# EAGLE design 5v-3.3v Stepdown Breakout (EAGLE 9.5.2)
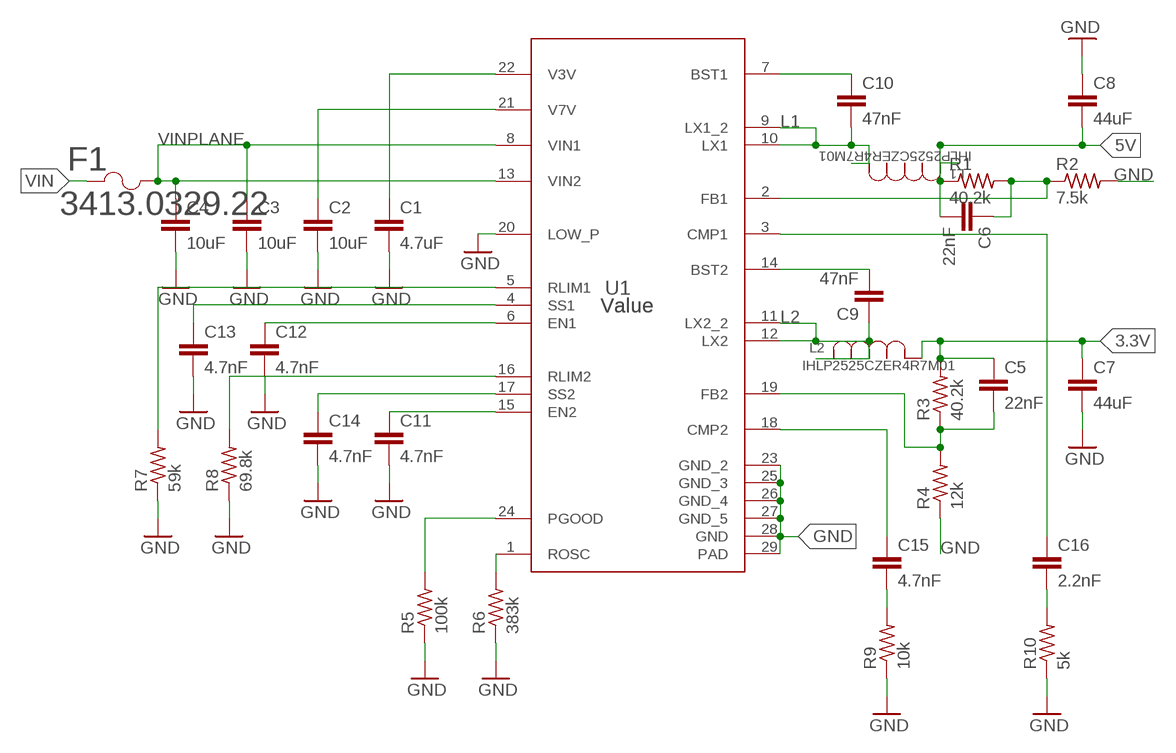
[diagram p0: schematic, sheet 1]

## Parts
C1  4.7uF  4.7UF-0402_TIGHT-6.3V-20%-X5R  [0402-TIGHT]
C2  10uF  10UF-0603-6.3V-20%  [0603]
C3  10uF  10UF-0603-6.3V-20%  [0603]
C4  10uF  10UF-0603-6.3V-20%  [0603]
C5  22nF  22NF/22,000PF-0603-25V-10%-X7R  [0402]
C6  22nF  22NF/22,000PF-0603-25V-10%-X7R  [0402]
C7  44uF  6PF-0402-50V-0.5%  [0402]
C8  44uF  6PF-0402-50V-0.5%  [0402]
C9  47nF  47NF-0402_TIGHT-25V-10%-X7R  [0402-TIGHT]
C10  47nF  47NF-0402_TIGHT-25V-10%-X7R  [0402-TIGHT]
C11  4.7nF  47NF-0402_TIGHT-25V-10%-X7R  [0402-TIGHT]
C12  4.7nF  47NF-0402_TIGHT-25V-10%-X7R  [0402-TIGHT]
C13  4.7nF  47NF-0402_TIGHT-25V-10%-X7R  [0402-TIGHT]
C14  4.7nF  47NF-0402_TIGHT-25V-10%-X7R  [0402-TIGHT]
C15  4.7nF  47NF-0402_TIGHT-25V-10%-X7R  [0402-TIGHT]
C16  2.2nF  47NF-0402_TIGHT-25V-10%-X7R  [0402-TIGHT]
F1  3413.0329.22  [FUS_SCHURTER_3413_SCH]
L1  IHLP2525CZER4R7M01  [IND25X25CZ]
L2  IHLP2525CZER4R7M01  [IND25X25CZ]
R1  40.2k  R-US_R0402  [R0402]
R2  7.5k  R-US_R0402  [R0402]
R3  40.2k  R-US_R0402  [R0402]
R4  12k  R-US_R0402  [R0402]
R5  100k  R-US_R0402  [R0402]
R6  383k  R-US_R0402  [R0402]
R7  59k  R-US_R0402  [R0402]
R8  69.8k  R-US_R0402  [R0402]
R9  10k  R-US_R0402  [R0402]
R10  5k  R-US_R0402  [R0402]
U1  Value  TPS65253RHDR  [RHD0028A]

## Nets
3.3V: C5.1 C7.1 L2.1 R3.2
5V: C6.2 C8.2 L1.2 R1.1
GND: C1.2 C2.2 C3.2 C4.2 C7.2 C8.1 C11.2 C12.2 C13.2 C14.2 R2.2 R4.1 R5.1 R6.1 R7.1 R8.1 R9.1 R10.1 U1.20(LOW_P) U1.23(GND_2) U1.25(GND_3) U1.26(GND_4) U1.27(GND_5) U1.28(GND) U1.29(PAD)
L1: C10.2 L1.1 U1.9(LX1_2) U1.10(LX1)
L2: C9.1 L2.2 U1.11(LX2_2) U1.12(LX2)
N$1: C2.1 U1.21(V7V)
N$2: C1.1 U1.22(V3V)
N$5: C5.2 R3.1 R4.2 U1.19(FB2)
N$6: C6.1 R1.2 R2.1 U1.2(FB1)
N$9: C9.2 U1.14(BST2)
N$10: C10.1 U1.7(BST1)
N$11: C12.1 U1.6(EN1)
N$12: C11.1 U1.15(EN2)
N$13: R5.2 U1.24(PGOOD)
N$14: C14.1 U1.17(SS2)
N$15: R6.2 U1.1(ROSC)
N$16: C13.1 U1.4(SS1)
N$17: R8.2 U1.16(RLIM2)
N$18: R7.2 U1.5(RLIM1)
N$19: C15.2 R9.2
N$20: C15.1 U1.18(CMP2)
N$21: C16.1 U1.3(CMP1)
N$22: C16.2 R10.2
VIN: F1.1
VINPLANE: C3.1 C4.1 F1.2 U1.8(VIN1) U1.13(VIN2)

## Library data of the parts
C1 = SparkFun-Capacitors:4.7UF: 4.7µF ceramic capacitors A capacitor is a passive two-terminal electrical component used to store electrical energy temporarily in an electric field.; PROD_ID: CAP-14240
C2-C4 = SparkFun-Capacitors:10UF: 10.0µF ceramic capacitors A capacitor is a passive two-terminal electrical component used to store electrical energy temporarily in an electric field.; PROD_ID: CAP-11015
C5 C6 = SparkFun-Capacitors:22NF/22,000PF: 0.022uF/22nF/22,000pF ceramic capacitors A capacitor is a passive two-terminal electrical component used to store electrical energy temporarily in an electric field.; PROD_ID: CAP-15062
C7 C8 = SparkFun-Capacitors:6PF: 6pF ceramic capacitors A capacitor is a passive two-terminal electrical component used to store electrical energy temporarily in an electric field.; PROD_ID: CAP-13455; VALUE: 6pF
C9 C10 = SparkFun-Capacitors:47NF: 47nF ceramic capacitors A capacitor is a passive two-terminal electrical component used to store electrical energy temporarily in an electric field.; PROD_ID: CAP-14243
C11-C16 = SparkFun-Capacitors:47NF: 47nF ceramic capacitors A capacitor is a passive two-terminal electrical component used to store electrical energy temporarily in an electric field.; PROD_ID: CAP-14243; VALUE: 47nF
F1 = 3413.0329.22 fuse:3413.0329.22; BUILT_BY: EMA_UL_Team; MANUFACTURER_PART_NUMBER: 3413.0329.22; SOURCELIBRARY: Schurter_2010-01-01_FUSE_3413; VENDOR: Schurter Inc
L1 L2 = IHLP2525CZER4R7M01:IHLP2525CZER4R7M01; BUILT_BY: EMA_UL_Team; MANUFACTURER_PART_NUMBER: IHLP2525CZER4R7M01; VENDOR: Vishay
R1-R10 = resistor:R-US_: RESISTOR, American symbol
U1 = TPS65253:TPS65253RHDR; MANUFACTURER: Texas Instruments; PARTNUMBER: TPS65253RHDR; REFDES: RefDes; TYPE: TYPE

## Board
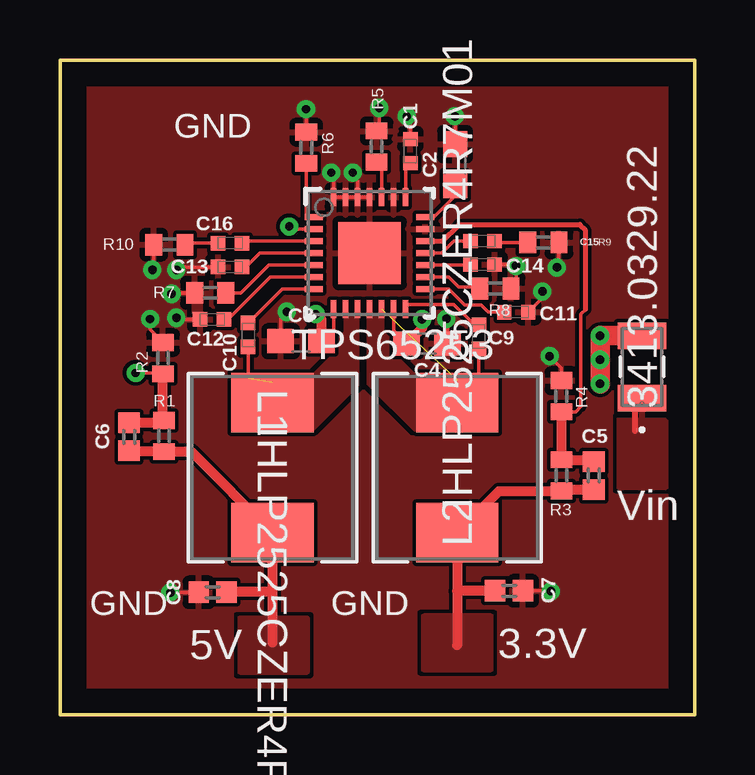
[diagram p1: board, top side]
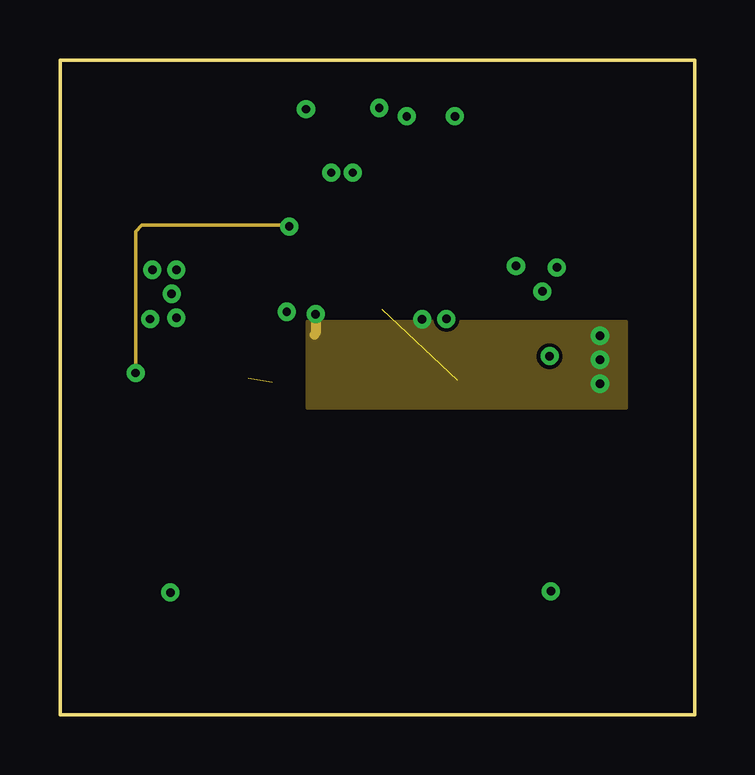
[diagram p2: board, inner layer Route15]
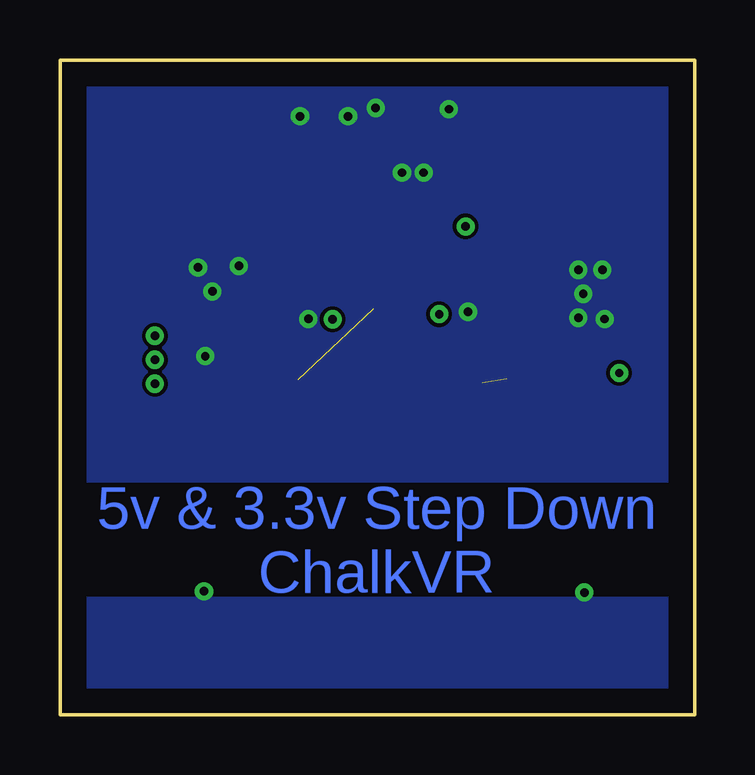
[diagram p3: board, bottom side, seen from below]

Size 26.45 x 27.3 mm. Coordinates in mm from the lower left corner, seen from the top.
Outline: 0,27.3 0,0 26.45,0 26.45,27.3 0,27.3
Copper layers (1+2*15+16): Top 0.035mm / dielectric 1.5mm / Route2 0.035mm / dielectric 0.15mm / Route15 0.035mm / dielectric 0.2mm / Bottom 0.035mm
Design rules "default *": minimum track width 6mil, minimum drill 0.35mm, track to track 6mil, track to pad 6mil, pad to pad 6mil, via to via 6mil, smd to smd 6mil, copper to edge 40mil, drill to drill 6mil, minimum pad ring 10mil, minimum via ring 8mil, stop-mask expansion 4mil, vias tented up to drill 0mil, thermal gap 10mil

### Footprints (pad centres in the part's own frame; a part is rotated, then mirrored left to right if it is on the bottom)
0402-TIGHT = smd 0.6 x 0.6: 1 -0.5,0; 2 0.5,0
0603 = smd 1.1 x 1: 1 -0.85,0; 2 0.85,0
0402 = smd 0.85 x 0.9: 1 -0.58,0; 2 0.58,0
FUS_SCHURTER_3413_SCH = smd 1.105 x 2.007: 1 -1.302,0; 2 1.302,0
IND25X25CZ = smd 2.479 x 3.429: 1 -2.713,0; 2 2.713,0
R0402 = smd 0.7 x 0.9: 1 -0.65,0; 2 0.65,0
RHD0028A = smd 0.75 x 0.24: 1 -2.325,1.5; 2 -2.325,1; 3 -2.325,0.5; 4 -2.325,0; 5 -2.325,-0.5; 6 -2.325,-1; 7 -2.325,-1.5; 15 2.325,-1.5; 16 2.325,-1; 17 2.325,-0.5; 18 2.325,0; 19 2.325,0.5; 20 2.325,1; 21 2.325,1.5 | smd 0.24 x 0.75: 8 -1.5,-2.325; 9 -1,-2.325; 10 -0.5,-2.325; 11 0,-2.325; 12 0.5,-2.325; 13 1,-2.325; 14 1.5,-2.325; 22 1.5,2.325; 23 1,2.325; 24 0.5,2.325; 25 0,2.325; 26 -0.5,2.325; 27 -1,2.325; 28 -1.5,2.325 | smd 2.6 x 2.6: 29 0,0

### Placement (x,y rotation side)
C1  14.6,23.5 90 top
C2  16.46,22.94 90 top
C3  10.04,15.58 180 top
C4  15.29,15.47 0 top
C5  22.24,9.97 90 top
C6  2.88,11.59 270 top
C7  18.71,5.17 0 top
C8  6.36,5.11 0 top
C9  17.45,15.76 90 top
C10  7.84,15.84 270 top
C11  19.01,16.78 0 top
C12  6.34,16.48 180 top
C13  7.09,18.67 180 top
C14  17.61,18.77 0 top
C15  17.61,19.75 0 top
C16  7.09,19.66 180 top
F1  24.25,14.5 90 top
L1  8.85,10.3 270 top
L2  16.55,10.3 90 top
R1  4.33,11.62 90 top
R2  4.29,14.87 90 top
R3  20.9,9.98 270 top
R4  20.89,13.28 270 top
R5  13.19,23.69 270 top
R6  10.26,23.64 270 top
R7  6.26,17.59 0 top
R8  18.14,17.77 180 top
R9  20.14,19.69 180 top
R10  4.56,19.6 0 top
U1  12.9,19.25 0 top

### Tracks (layer width: path | path; a pad name or v marks a point on that pad's centre or on a via)
3.3V
  Top 0.152: 22.15,9.39 C5.1
  Top 0.406: 16.55,5.15 L2.1 18.29,9.33 R3.2 20.96,9.39 22.15,9.39 | 16.55,5.15 16.55,2.9 | C7.1 16.57,5.17 16.55,5.15
  pour Top: 15.15,4.1 15.15,1.9 17.95,1.9 17.95,4.1
5V
  Top 0.406: 8.85,5.15 L1.2 5.47,10.97 R1.1 2.92,10.97 C6.2 | 8.85,5.15 8.85,3 | C8.2 6.98,5.15 8.85,5.15
  pour Top: 10.3,4 7.5,4 7.5,1.8 10.3,1.8
GND  (via drill 0.35)
  Top 0.152: C3.2 9.19,16.54 v9.45,16.8 | C4.2 16.14,16.46 v16.1,16.5 | C7.2 20.43,5.17 v20.45,5.15 | C8.1 v4.6,5.1 | R5.1 13.3,24.45 v13.3,25.3 | C1.2 14.6,24.8 v14.45,24.95 | v10.25,25.25 R6.1 | C13.2 4.97,18.67 v4.85,18.55 | R7.1 4.69,17.59 v4.65,17.55 | C12.2 4.92,16.48 v4.85,16.55 | R10.1 3.91,18.61 v3.85,18.55 | U1.25 U1.28 11.4,22.5 v11.3,22.6 | U1.26 12.4,22.25 12.2,22.45 v12.2,22.6 | C2.2 v16.46,24.94 v16.45,24.95 | R9.1 20.79,18.74 v20.7,18.65 | C14.2 18.94,18.77 v19,18.71 19,17.98 R8.1 | C11.2 20.1,17.37 v20.1,17.65 | R2.2 3.76,16.05 v3.76,16.5 | R4.1 20.89,14.46 v20.4,14.95
  pour Bottom: 0,27.3 0,0 26.45,0 26.45,27.3
  pour Top (rank 2): 0,27.3 0,0 26.45,0 26.45,27.3
L1  (1 unrouted)
  Top 0.152: C10.2 7.84,14.02
  Top 0.61: L1.1 8.85,12.45
  Top 0.813: 8.85,13.85 L1.1 8.85,13.05
  pour Top (no thermals): 12.45,16.65 11.85,16.65 11.85,15.95 11.55,15.65 11.55,15.2 10.55,14.2 10.55,11.85 12.45,13.75
L2  (1 unrouted)
  Top 0.152: C9.1 17.45,13.91 L2.2
  Top 0.61: 16.55,12.45 L2.2 16.55,13.95
  pour Top (no thermals): 12.85,16.6 13.45,16.6 13.45,15.95 13.7,15.7 13.7,15.25 14.8,14.15 14.8,11.85 12.85,13.8
N$1
  Top 0.152: U1.21 15.57,20.75 16.46,21.64 C2.1
N$2
  Top 0.152: U1.22 14.4,22.8 C1.1
N$5
  Top 0.152: R4.2 21.48,12.63 21.7,12.85 21.7,16.7 21.9,16.9
  Top 0.2: U1.19 15.25,19.73 15.91,19.73 16.63,20.44 21.66,20.44 21.9,20.2 21.9,16.9
  Top 0.406: C5.2 22.16,10.63 R3.1 R4.2
N$6  (via drill 0.35)
  Top 0.152: U1.2 9.66,20.25 v9.55,20.36 | v3.15,14.25 4.26,14.25 R2.1
  Top 0.406: C6.1 4.23,12.17 R1.2 4.29,12.31 R2.1
  Route15 0.152: v9.55,20.36 9.5,20.41 3.41,20.41 3.15,20.15 v3.15,14.25
N$9
  Top 0.152: C9.2 17.25,16.26 16.4,17.11 14.48,17.11 14.4,17.02 U1.14
N$10
  Top 0.152: C10.1 9.25,17.75 U1.7
N$11
  Top 0.152: U1.6 8.76,18.25 6.99,16.48 C12.1
N$12
  Top 0.152: U1.15 16.2,17.75 16.86,17.09 17.55,17.09 17.85,16.78 C11.1
N$13
  Top 0.152: U1.24 13.4,22.83 R5.2
N$14
  Top 0.152: U1.17 16.05,18.75 16.15,18.75 17.09,18.75 C14.1
N$15
  Top 0.152: U1.1 10.38,20.75 10.26,20.86 R6.2
N$16
  Top 0.152: C13.1 7.74,18.67 8.32,19.25 U1.4
N$17
  Top 0.152: U1.16 16.21,18.25 16.62,17.84 17.42,17.84 R8.2
N$18
  Top 0.152: U1.5 8.7,18.75 7.54,17.59 R7.2
N$19
  Top 0.152: R9.2 18.17,19.69 C15.2
N$20
  Top 0.152: U1.18 15.9,19.25 16.4,19.75 C15.1
N$21
  Top 0.152: U1.3 10.15,19.75 9.2,19.75 7.68,19.75 C16.1
N$22
  Top 0.152: C16.2 5.27,19.66 R10.2
VIN
  Top 0.254: F1.1 23.95,12.9 23.95,11.85
  pour Top: 23.3,12.55 23.3,9.5 25.25,9.5 25.25,12.2 24.9,12.55
VINPLANE  (via drill 0.35)
  Top 0.152: U1.8 11.4,16.09 C3.1 | U1.13 13.9,16.01 C4.1 14.56,15.59
  Top 0.406: v10.65,16.7 10.89,16.46 C3.1 | v15.09,16.49 15.09,16.12 14.56,15.59
  Top 0.61: v22.5,15.8
  Top 0.813: F1.2 v22.5,15.8 | v22.5,15.8 v22.5,13.8
  Route15 0.406: v10.65,16.7 10.65,15.9 10.6,15.85
  other vias: 22.5,14.8
  pour Route15: 10.3,16.4 10.3,12.8 23.6,12.8 23.6,16.4

### Text on the board
Bottom: 5v & 3.3v Step Down / ChalkVR
tNames: GND | GND | Vin | GND | GND | GND | GND | 5V | 3.3V